# Altium schematic sheet 2016-02-19_06-42-491.schdoc
size 316 x 120 mm; SheetNumber: 1; SheetTotal: 1
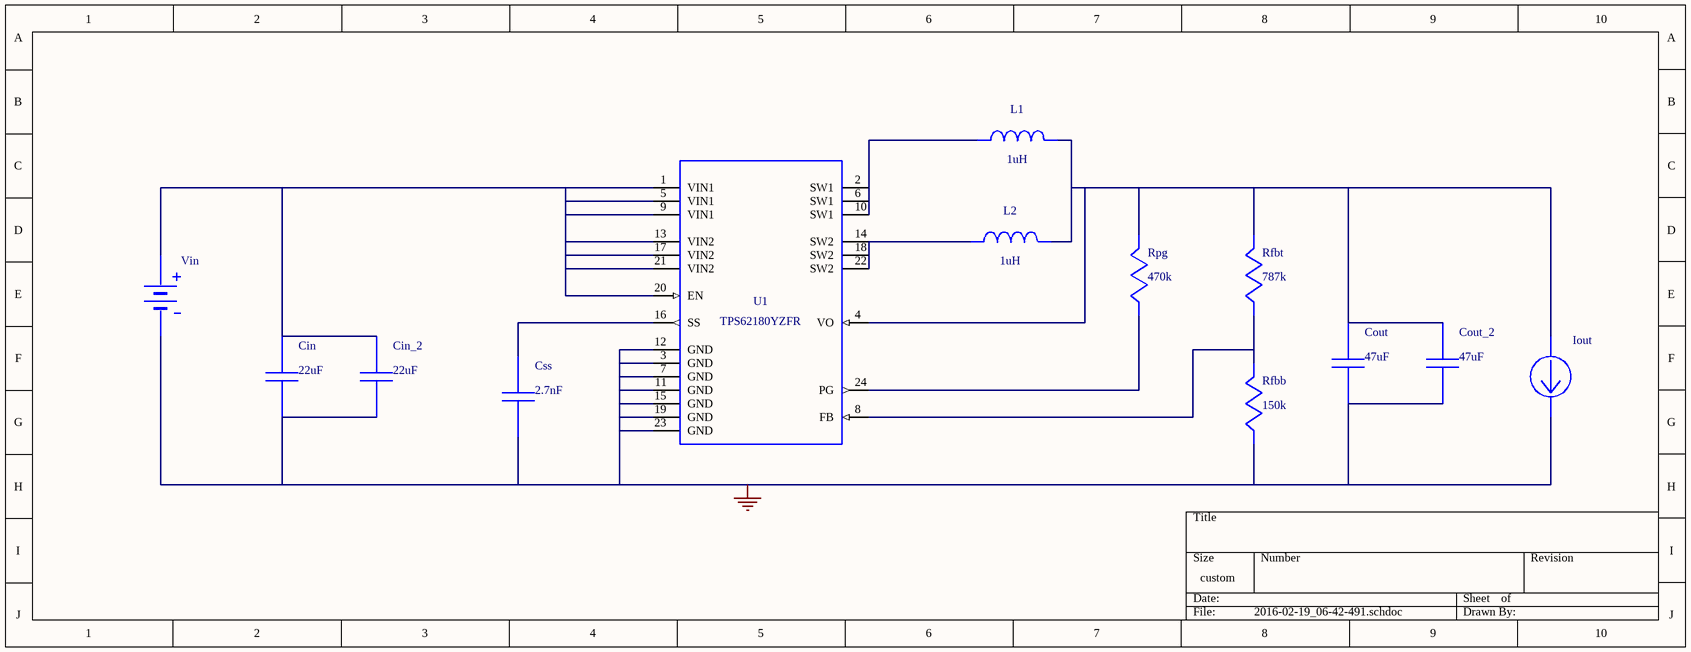
[diagram p0: 2016-02-19_06-42-491.schdoc]

## Parts
Cin  value 22uF  (hidden comment: C3225X6S1C226M)
Cin_2  value 22uF  (hidden comment: C3225X6S1C226M)
Cout  value 47uF  (hidden comment: GRM31CR61A476KE15L)
Cout_2  value 47uF  (hidden comment: GRM31CR61A476KE15L)
Css  value 2.7nF  (hidden comment: GRM188R71E272KA01D)
Iout  WB_CURRENT_LOAD  (value not drawn)
L1  value 1uH  (hidden comment: IHLP1212BZER1R0M11)
L2  value 1uH  (hidden comment: IHLP1212BZER1R0M11)
Rfbb  value 150k  (hidden comment: CRCW0402150KFKED)
Rfbt  value 787k  (hidden comment: CRCW0402787KFKED)
Rpg  value 470k  (hidden comment: RC0603FR-07470KL)
U1  TPS62180YZFR
Vin  WB_BATTERY  (value not drawn)

## Nets
0: Cin.2 Cin_2.2 Cout.2 Cout_2.2 Css.2 Iout.2(-) Rfbb.2 U1.3(GND) U1.7(GND) U1.11(GND) U1.12(GND) U1.15(GND) U1.19(GND) U1.23(GND) Vin.2(-)
NetCin_1: Cin.1 Cin_2.1 U1.1(VIN1) U1.5(VIN1) U1.9(VIN1) U1.13(VIN2) U1.17(VIN2) U1.20(EN) U1.21(VIN2) Vin.1(+)
NetCout_1: Cout.1 Cout_2.1 Iout.1(+) L1.2 L2.2 Rfbt.1 Rpg.1 U1.4(VO)
NetCss_1: Css.1 U1.16(SS)
NetL1_1: L1.1 U1.2(SW1) U1.6(SW1) U1.10(SW1)
NetL2_1: L2.1 U1.14(SW2) U1.18(SW2) U1.22(SW2)
NetRfbb_1: Rfbb.1 Rfbt.2 U1.8(FB)
NetRpg_2: Rpg.2 U1.24(PG)

## Library data of the parts
Cin Cin_2 = C3225X6S1C226M: Manufacturer Name: TDK; PackageReference: C3225X6S1C226M; Manufacturer Part Number: C3225X6S1C226M
Cout Cout_2 = GRM31CR61A476KE15L: GRM31CR61A476KE1; Manufacturer Name: MuRata; PackageReference: GRM31CR61A476KE15L; Manufacturer Part Number: GRM31CR61A476KE15L
Css = GRM188R71E272KA01D: GRM188R71E272KA0; Manufacturer Name: MuRata; PackageReference: GRM188R71E272KA01D; Manufacturer Part Number: GRM188R71E272KA01D
Iout = WB_CURRENT_LOAD: Value: UNLISTED; PackageReference: WB_CURRENT_LOAD; Manufacturer Part Number: WB_CURRENT_LOAD; Manufacturer Name: WB_CURRENT_LOAD
L1 L2 = IHLP1212BZER1R0M11: Unknown; Manufacturer Name: Vishay-Dale; PackageReference: IHLP1212BZER1R0M11; Manufacturer Part Number: IHLP1212BZER1R0M11
Rfbb = CRCW0402150KFKED: Manufacturer Name: Vishay-Dale; PackageReference: CRCW0402150KFKED; Manufacturer Part Number: CRCW0402150KFKED
Rfbt = CRCW0402787KFKED: Manufacturer Name: Vishay-Dale; PackageReference: CRCW0402787KFKED; Manufacturer Part Number: CRCW0402787KFKED
Rpg = RC0603FR-07470KL: Manufacturer Name: Yageo America; PackageReference: RC0603FR-07470KL; Manufacturer Part Number: RC0603FR-07470KL
U1 = TPS62180YZFR: Manufacturer Name: Texas Instruments; Value: UNLISTED; PackageReference: TPS62180YZFR; Manufacturer Part Number: TPS62180YZFR
Vin = WB_BATTERY: Value: UNLISTED; PackageReference: WB_BATTERY; Manufacturer Part Number: WB_BATTERY; Manufacturer Name: WB_BATTERY